# Altium schematic sheet Sensor_DS18b20_1Wire.SchDoc
size A4; Organization: Q-Tech Design; Address1: Da Nang City; Address2: Viet Nam; DocumentNumber: 5; SheetNumber: 5; SheetTotal: 7
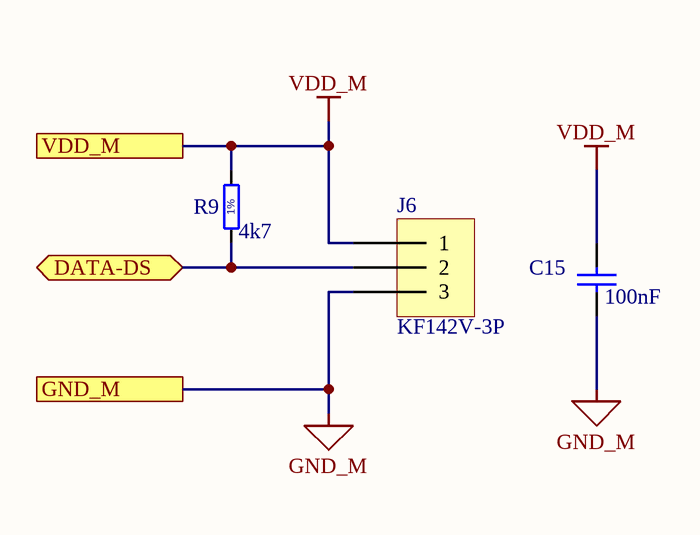
[diagram p0: Sensor_DS18b20_1Wire.SchDoc]

## Parts
C15  100nF  [CAPC1608X87N]
J6  KF142V-3P  [CON KF142V-3P-5.08]
R9  4k7  [RESC1608X55N]

## Ports
DATA-DS (bidir), GND_M, VDD_M

## Nets
GND_M: C15.1 J6.3 ; port GND_M
VDD_M: C15.2 J6.1 R9.2 ; port VDD_M
DATA-DS: J6.2 R9.1 ; port DATA-DS

## Notes on the sheet
- Page Title:
- Date:
- Title:
- DRE:
- Time:
- Number:
- Sheet
- Rev:
- of
- Q-Tech confidential and proprietary. Restricted access under NDA. Do not reproduce. Store and dispose securely.
- (in symbol R0603_4K7_1%_0.1W_100PPM) 1%

## Library data of the parts
C15 = CC0603_100NF_50V_10%_X7R: Non-polarised capacitor; Part Description: SMD Multilayer Chip Ceramic Capacitor; Manufacturer: GENERIC; Manufacturer1 Part Number: 223858615649; Voltage: 50V; TC: X7R; Tolerance: ±10%; Table: Capacitors SMD; Part Number: CC0603_100NF_50V_10%_X7R; Component Kind: Standard; Component Type: Standard; Pin Count: 2; Value: 100nF; Status: Preferred; Manufacturer Part Number: CC0603_100NF_50V_10%_X7R; Case: 0603; Mounted: Yes; Socket: No; SMD: Yes; Manufacturer1 Example: PHYCOMP; Manufacturer1 ComponentHeight: 0.87mm; HelpURL: \\cern.ch\dfs\Applications\Altium\Datasheets\CC0603_X7R_PHYCOMP.pdf; Author: CERN DEM JLC; CreateDate: 03-Dec-07; LatestRevisionDate: 03-Dec-07
J6 = CON KF142V-3P-5.08
R9 = R0603_4K7_1%_0.1W_100PPM: Resistor - 1%; Part Description: General Purpose Thick Film Chip Resistor; Manufacturer: GENERIC; Manufacturer1 Part Number: NRC06F4701TRF; Power: 0.1W; TC: ±100ppm/°C; Table: Resistors SMD; Part Number: R0603_4K7_1%_0.1W_100PPM; Component Kind: Standard; Component Type: Standard; Pin Count: 2; Value: 4k7; Status: Preferred; Tolerance: ±1%; Manufacturer Part Number: R0603_4K7_1%_0.1W_100PPM; Case: 0603; Mounted: Yes; Socket: No; SMD: Yes; Manufacturer1 Example: NIC COMPONENT; Manufacturer1 ComponentHeight: 0.55mm; HelpURL: \\cern.ch\dfs\Applications\Altium\Datasheets\R0603_NIC_NRC.pdf; Author: CERN DEM JLC; CreateDate: 03-Dec-07; LatestRevisionDate: 13-Mar-08